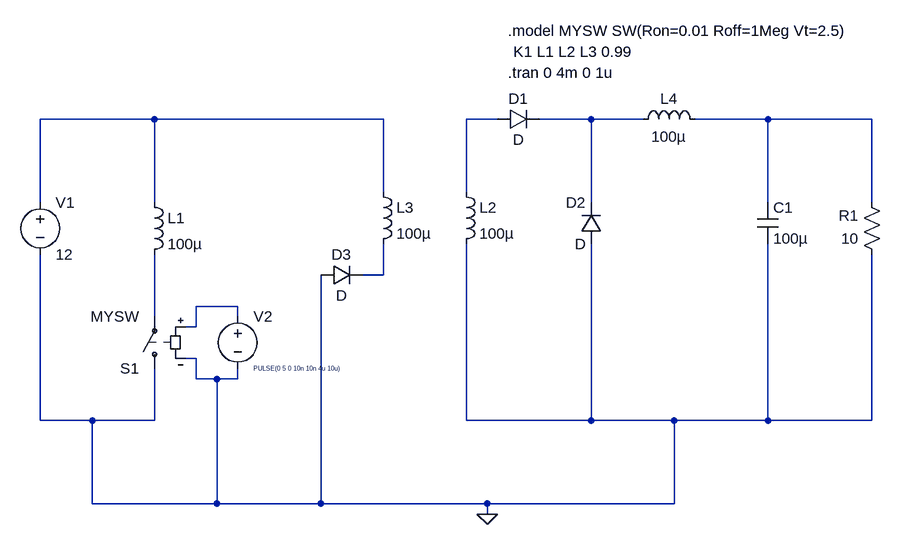
[diagram p0: schematic forward.asc]
forward.asc, the LTspice schematic file:
Version 4.1
SHEET 1 1124 680
WIRE 0 32 -176 32
WIRE 352 32 0 32
WIRE 528 32 480 32
WIRE 672 32 592 32
WIRE 752 32 672 32
WIRE 944 32 832 32
WIRE 1104 32 944 32
WIRE 352 144 352 32
WIRE 480 144 480 32
WIRE -176 160 -176 32
WIRE 0 160 0 32
WIRE 672 160 672 32
WIRE 944 160 944 32
WIRE 1104 160 1104 32
WIRE 352 272 352 224
WIRE 352 272 320 272
WIRE 128 320 64 320
WIRE 0 336 0 240
WIRE 128 336 128 320
WIRE 64 352 64 320
WIRE 64 352 48 352
WIRE 64 400 48 400
WIRE 64 432 64 400
WIRE 96 432 64 432
WIRE 128 432 128 416
WIRE 128 432 96 432
WIRE -176 496 -176 240
WIRE -96 496 -176 496
WIRE 0 496 0 416
WIRE 0 496 -96 496
WIRE 480 496 480 224
WIRE 672 496 672 224
WIRE 672 496 480 496
WIRE 800 496 672 496
WIRE 944 496 944 224
WIRE 944 496 800 496
WIRE 1104 496 1104 240
WIRE 1104 496 944 496
WIRE -96 624 -96 496
WIRE 96 624 96 432
WIRE 96 624 -96 624
WIRE 256 624 256 272
WIRE 256 624 96 624
WIRE 512 624 256 624
WIRE 800 624 800 496
WIRE 800 624 512 624
WIRE 512 640 512 624
FLAG 512 640 0
SYMBOL voltage -176 144 R0
WINDOW 123 0 0 Left 0
WINDOW 39 0 0 Left 0
SYMATTR InstName V1
SYMATTR Value 12
SYMBOL ind -16 144 R0
SYMATTR InstName L1
SYMATTR Value 100µ
SYMATTR SpiceLine Rser=0.1
SYMBOL ind 464 128 R0
SYMATTR InstName L2
SYMATTR Value 100µ
SYMATTR SpiceLine Rser=0.1
SYMBOL ind 336 128 R0
SYMATTR InstName L3
SYMATTR Value 100µ
SYMATTR SpiceLine Rser=0.1
SYMBOL diode 528 48 R270
WINDOW 0 32 32 VTop 2
WINDOW 3 0 32 VBottom 2
SYMATTR InstName D1
SYMBOL sw 0 432 R180
SYMATTR InstName S1
SYMATTR Value MYSW
SYMBOL diode 688 224 R180
WINDOW 0 24 64 Left 2
WINDOW 3 24 0 Left 2
SYMATTR InstName D2
SYMBOL diode 256 288 R270
WINDOW 0 32 32 VTop 2
WINDOW 3 0 32 VBottom 2
SYMATTR InstName D3
SYMBOL res 1120 256 R180
WINDOW 0 36 76 Left 2
WINDOW 3 36 40 Left 2
SYMATTR InstName R1
SYMATTR Value 10
SYMBOL cap 928 160 R0
SYMATTR InstName C1
SYMATTR Value 100µ
SYMBOL voltage 128 320 R0
WINDOW 3 24 96 Left 0
WINDOW 123 0 0 Left 0
WINDOW 39 0 0 Left 0
SYMATTR Value PULSE(0 5 0 10n 10n 4u 10u)
SYMATTR InstName V2
SYMBOL ind 736 48 R270
WINDOW 0 32 56 VTop 2
WINDOW 3 5 56 VBottom 2
SYMATTR InstName L4
SYMATTR Value 100µ
TEXT 544 -104 Left 2 !.model MYSW SW(Ron=0.01 Roff=1Meg Vt=2.5)
TEXT 552 -72 Left 2 !K1 L1 L2 L3 0.99
TEXT 544 -40 Left 2 !.tran 0 4m 0 1u

The netlist it stands for:
* forward.asc
V1 N001 0 12
L1 N001 N007 100µ Rser=0.1
L2 N002 0 100µ Rser=0.1
L3 N001 N005 100µ Rser=0.1
D1 N002 N003 D
S1 0 N007 N006 0 MYSW
D2 0 N003 D
D3 0 N005 D
R1 0 N004 10
C1 N004 0 100µ
V2 N006 0 PULSE(0 5 0 10n 10n 4u 10u)
L4 N003 N004 100µ
.model D D
.lib standard.dio
.model MYSW SW(Ron=0.01 Roff=1Meg Vt=2.5)
K1 L1 L2 L3 0.99
.tran 0 4m 0 1u
.backanno
.end